# EasyEDA Pro project 小车.eprj

# Schematic Schematic1
Create Date: 2024-05-27; Page Name: P1; Project Name: 小车; Schematic Name: Schematic1; Update Date: 2024-06-05; Add into BOM: yes; Company: 嘉立创EDA; Convert to PCB: yes; Page Size: A4; Version: V1.0
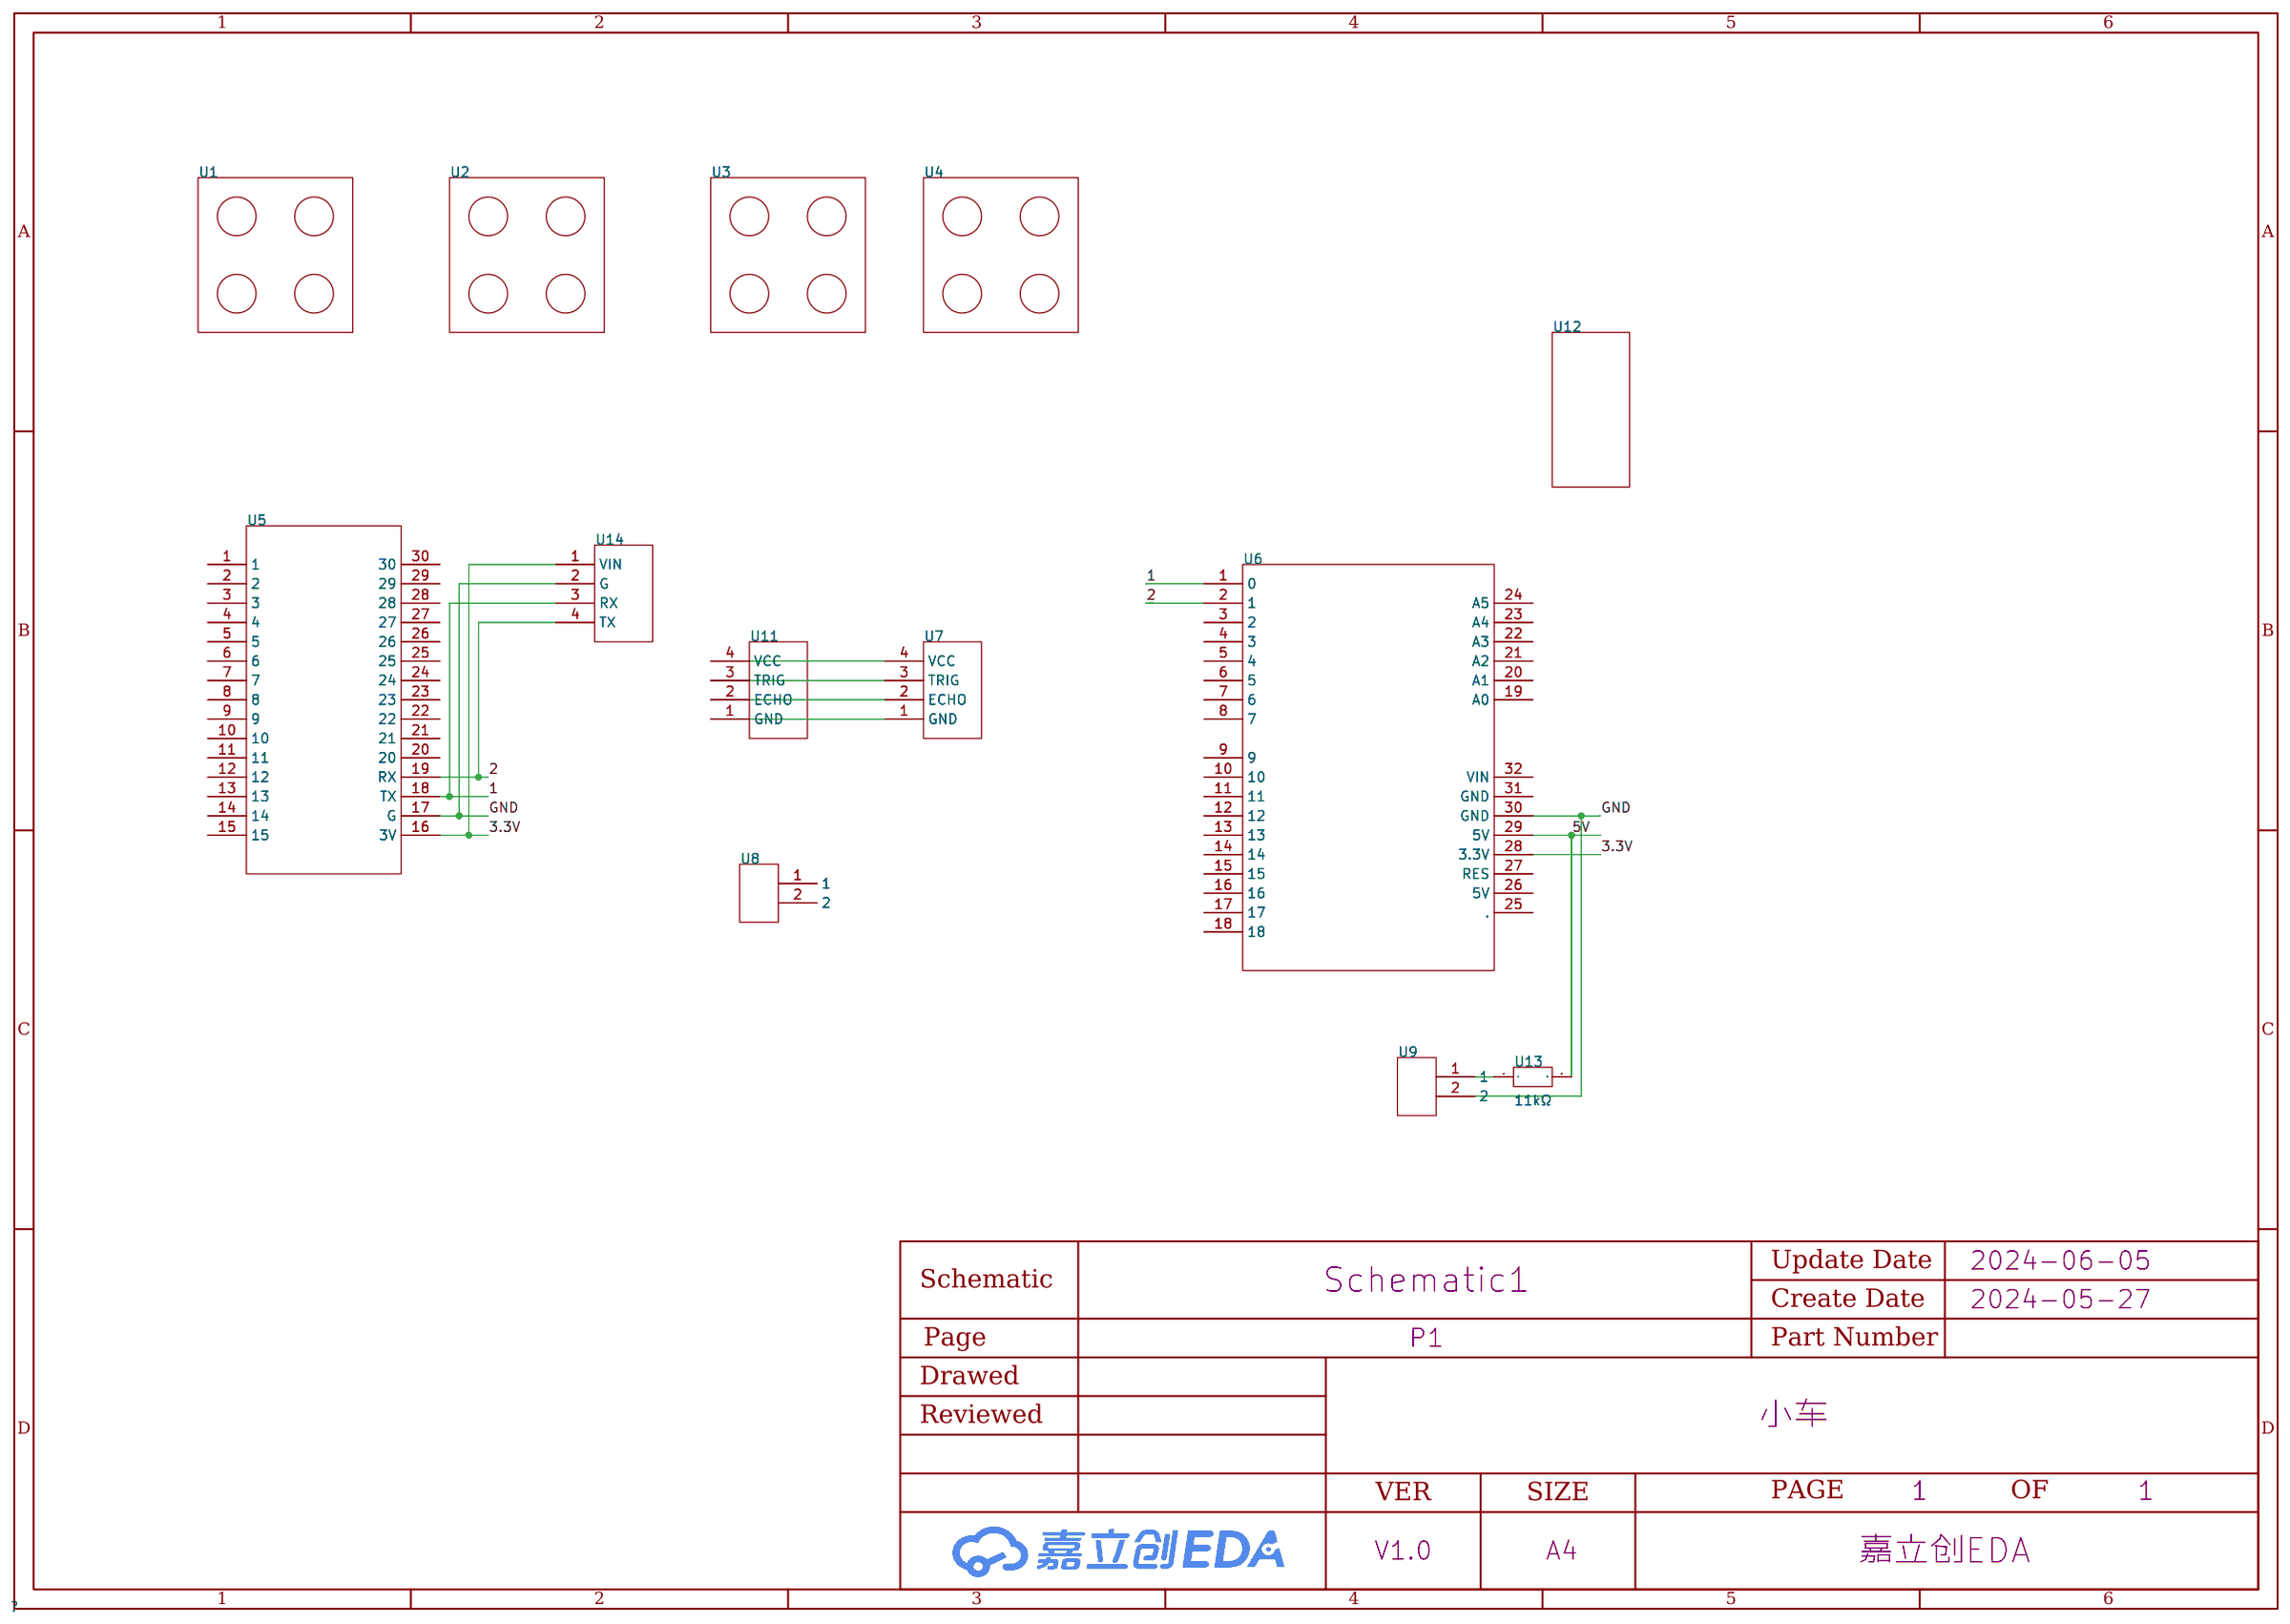
[diagram p0: schematic sheet]

## Parts
U1  -  [车轮]
U2  -  [车轮]
U3  -  [车轮]
U4  -  [车轮]
U5  -  [蓝牙]
U6  -  [开发板]
U7  -  [雷达]
U8  -  [开关]
U9  -  [开关]
U11  -  [雷达]
U12  -  [舵机]
U13  11kΩ  [RES-TH_BD2.3-L6.0-P10.00-D0.6]
U14  -  [OPENMV]

## Library data of the parts
U1-U4 = 车轮
U5 = 蓝牙
U6 = 开发板
U7 U11 = 雷达
U8 U9 = 开关
U12 = 舵机
U13 = RN55D1102FB14: 电阻类型:金属膜电阻;阻值:11kΩ;精度:±1%;功率:125mW;温度系数:±100ppm/℃;; LCSC Part Name: 金属膜电阻 11kΩ ±1% 125mW; Supplier Part: C1367638; Manufacturer: VISHAY(威世); Supplier Footprint: 插件,D2.3xL6.1mm; JLCPCB Part Class: 扩展库; Datasheet: https://atta.szlcsc.com/upload/public/pdf/source/20210608/50382EE0E4B78D1CB67FEFC4EAC5A602.pdf; Supplier: LCSC; Type: 金属膜电阻; Tolerance: ±1%; Power(Watts): 125mW; Temperature Coefficient: ±100ppm/℃; Operating Temperature Range: -65℃~+175℃
U14 = opnemv

## Nets
3.3V: U5.16(3V) U6.28(3.3V) U14.1(VIN)
5V: U6.29(5V) U13.2
GND: U5.17(G) U6.30(GND) U9.2 U14.2(G)
1: U5.18(TX) U6.1(0) U14.3(RX)
2: U5.19(RX) U6.2(1) U14.4(TX)
$1N1415: U9.1 U13.1
$1N1633: U7.4(VCC) U11.4(VCC)
$1N1636: U7.3(TRIG) U11.3(TRIG)
$1N1639: U7.2(ECHO) U11.2(ECHO)
$1N1642: U7.1(GND) U11.1(GND)

Not connected (* = marked no-connect by the designer): U5 1 2 3 4 5 6 7 8 9 10 11 12 13 14 15 20 21 22 23 24 25 26 27 28 29 30; U6 3(2) 4(3) 5(4) 6(5) 7(6) 8(7) 9 10 11 12 13 14 15 16 17 18 19(A0) 20(A1) 21(A2) 22(A3) 23(A4) 24(A5) 25(.) 26(5V) 27(RES) 31(GND) 32(VIN); U8 1 2

# Board PCB1
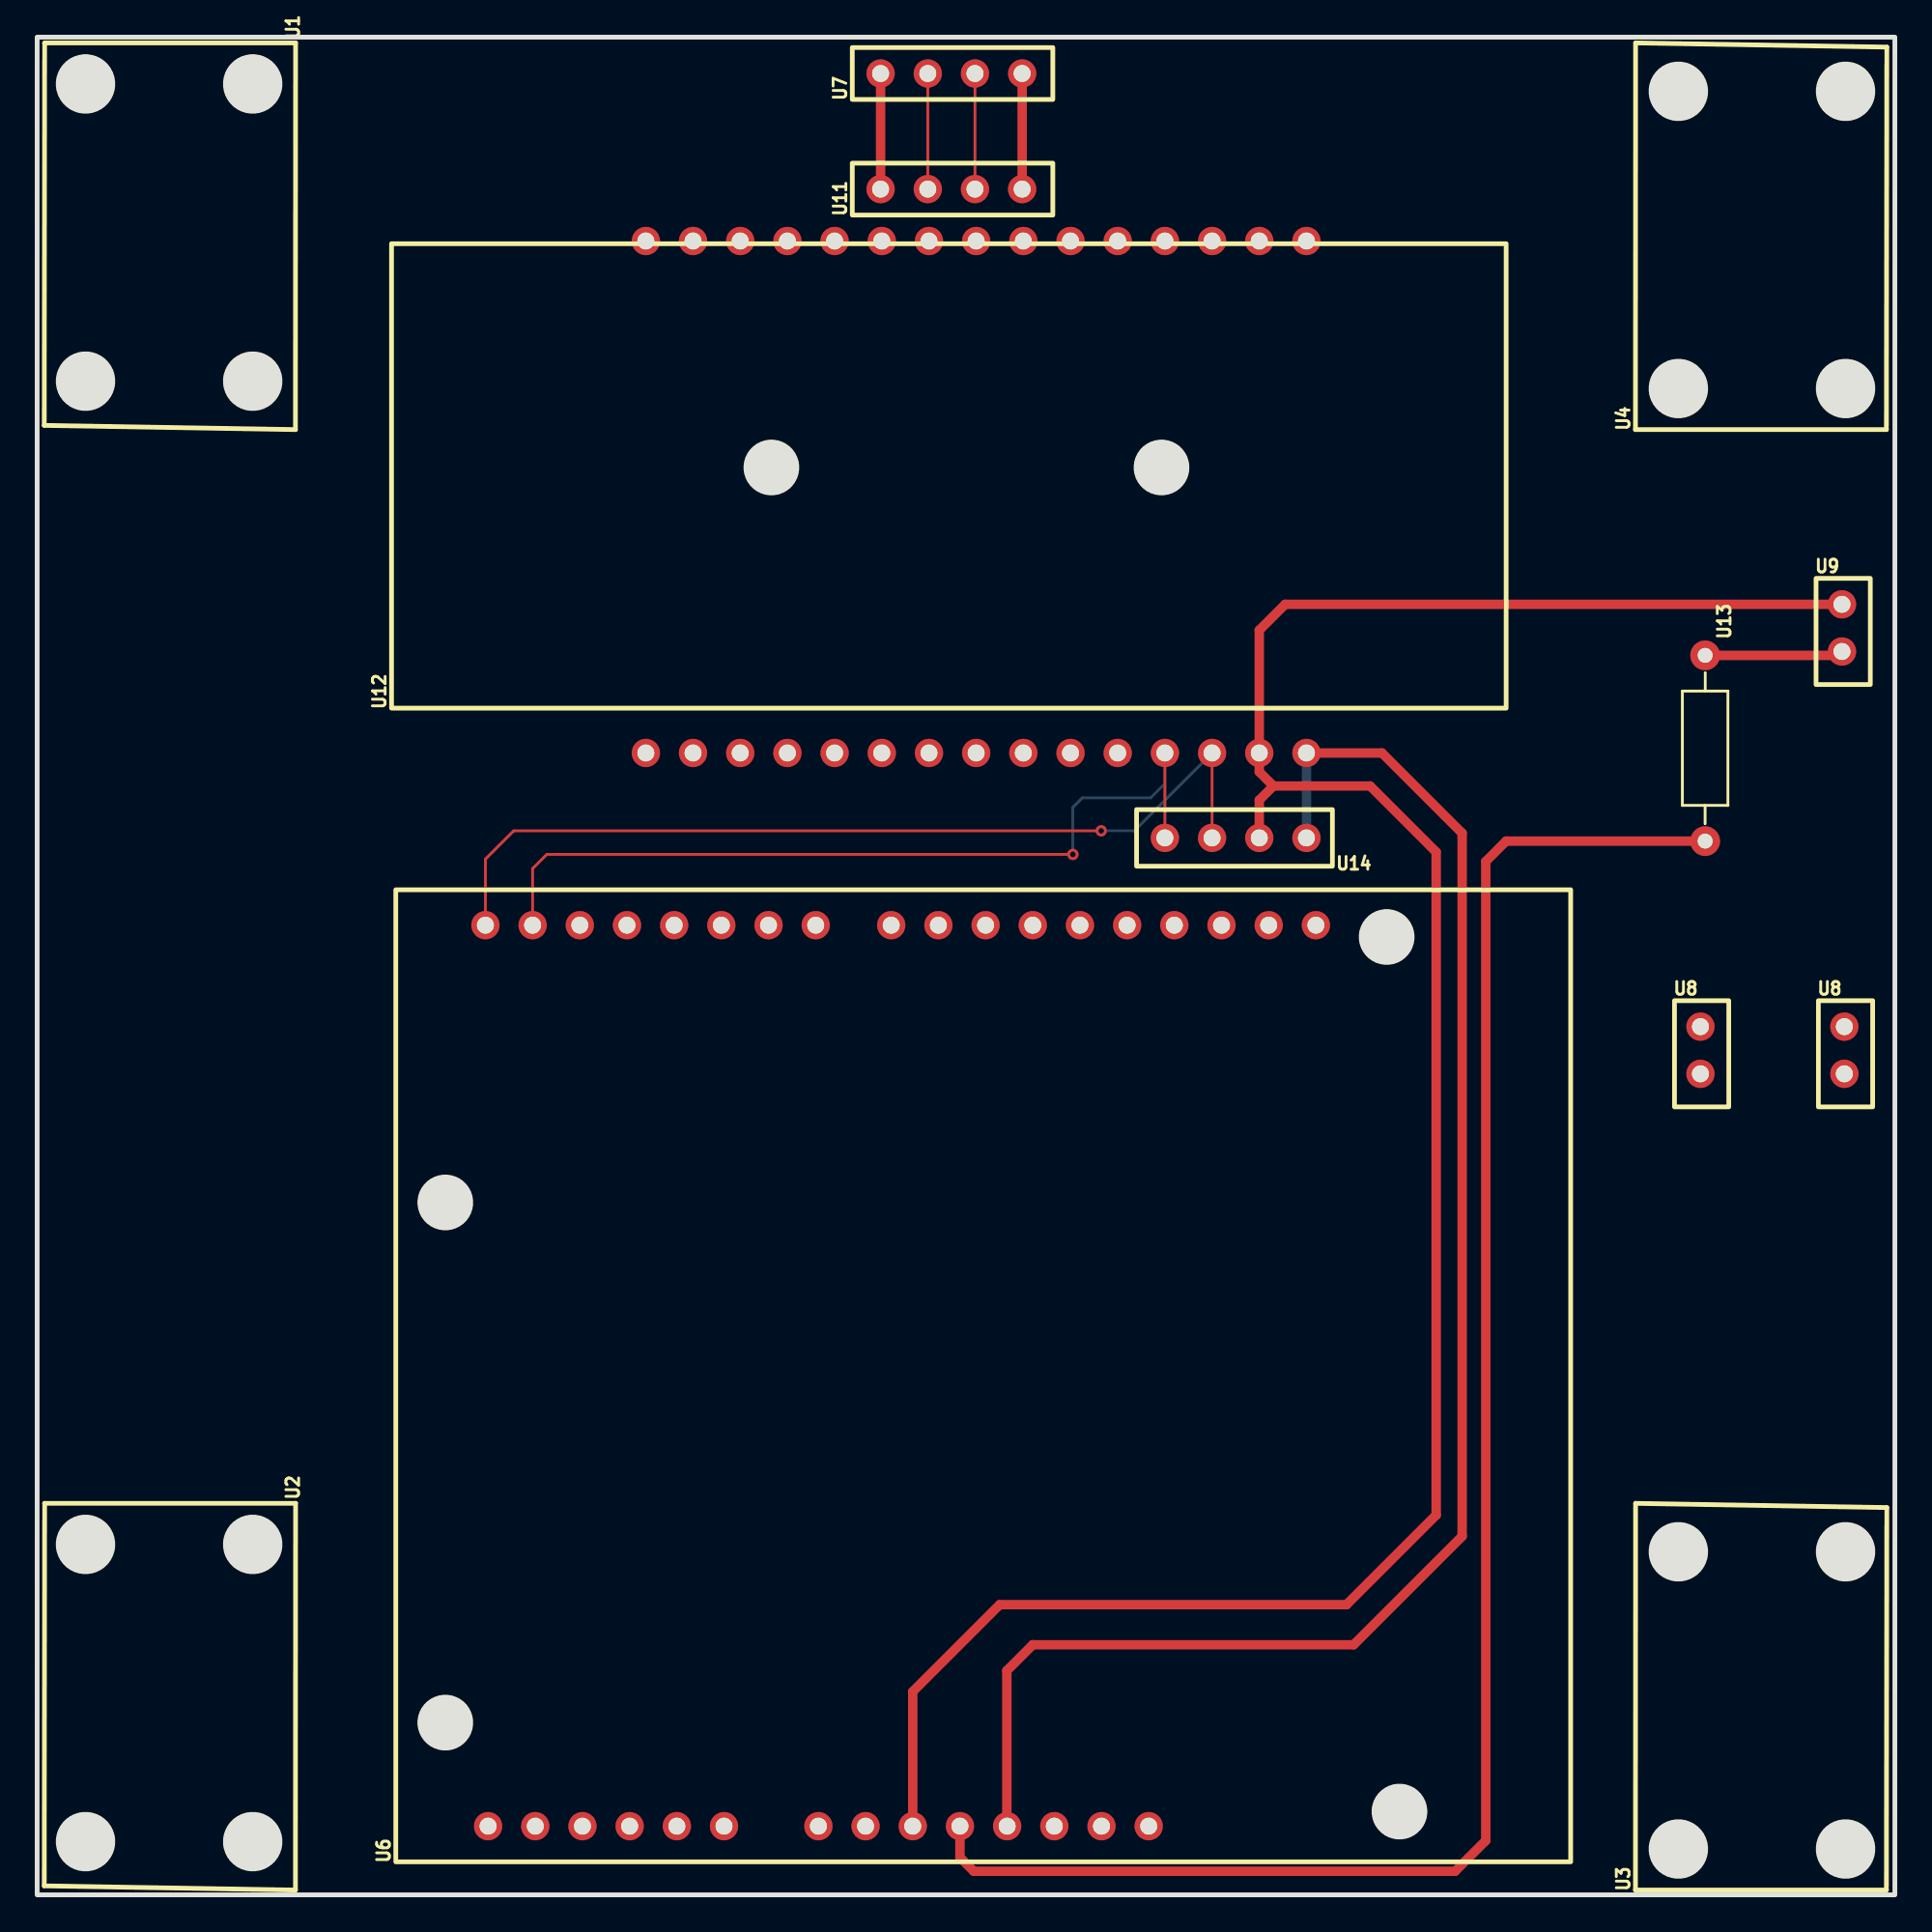
[diagram p1: board, top side]
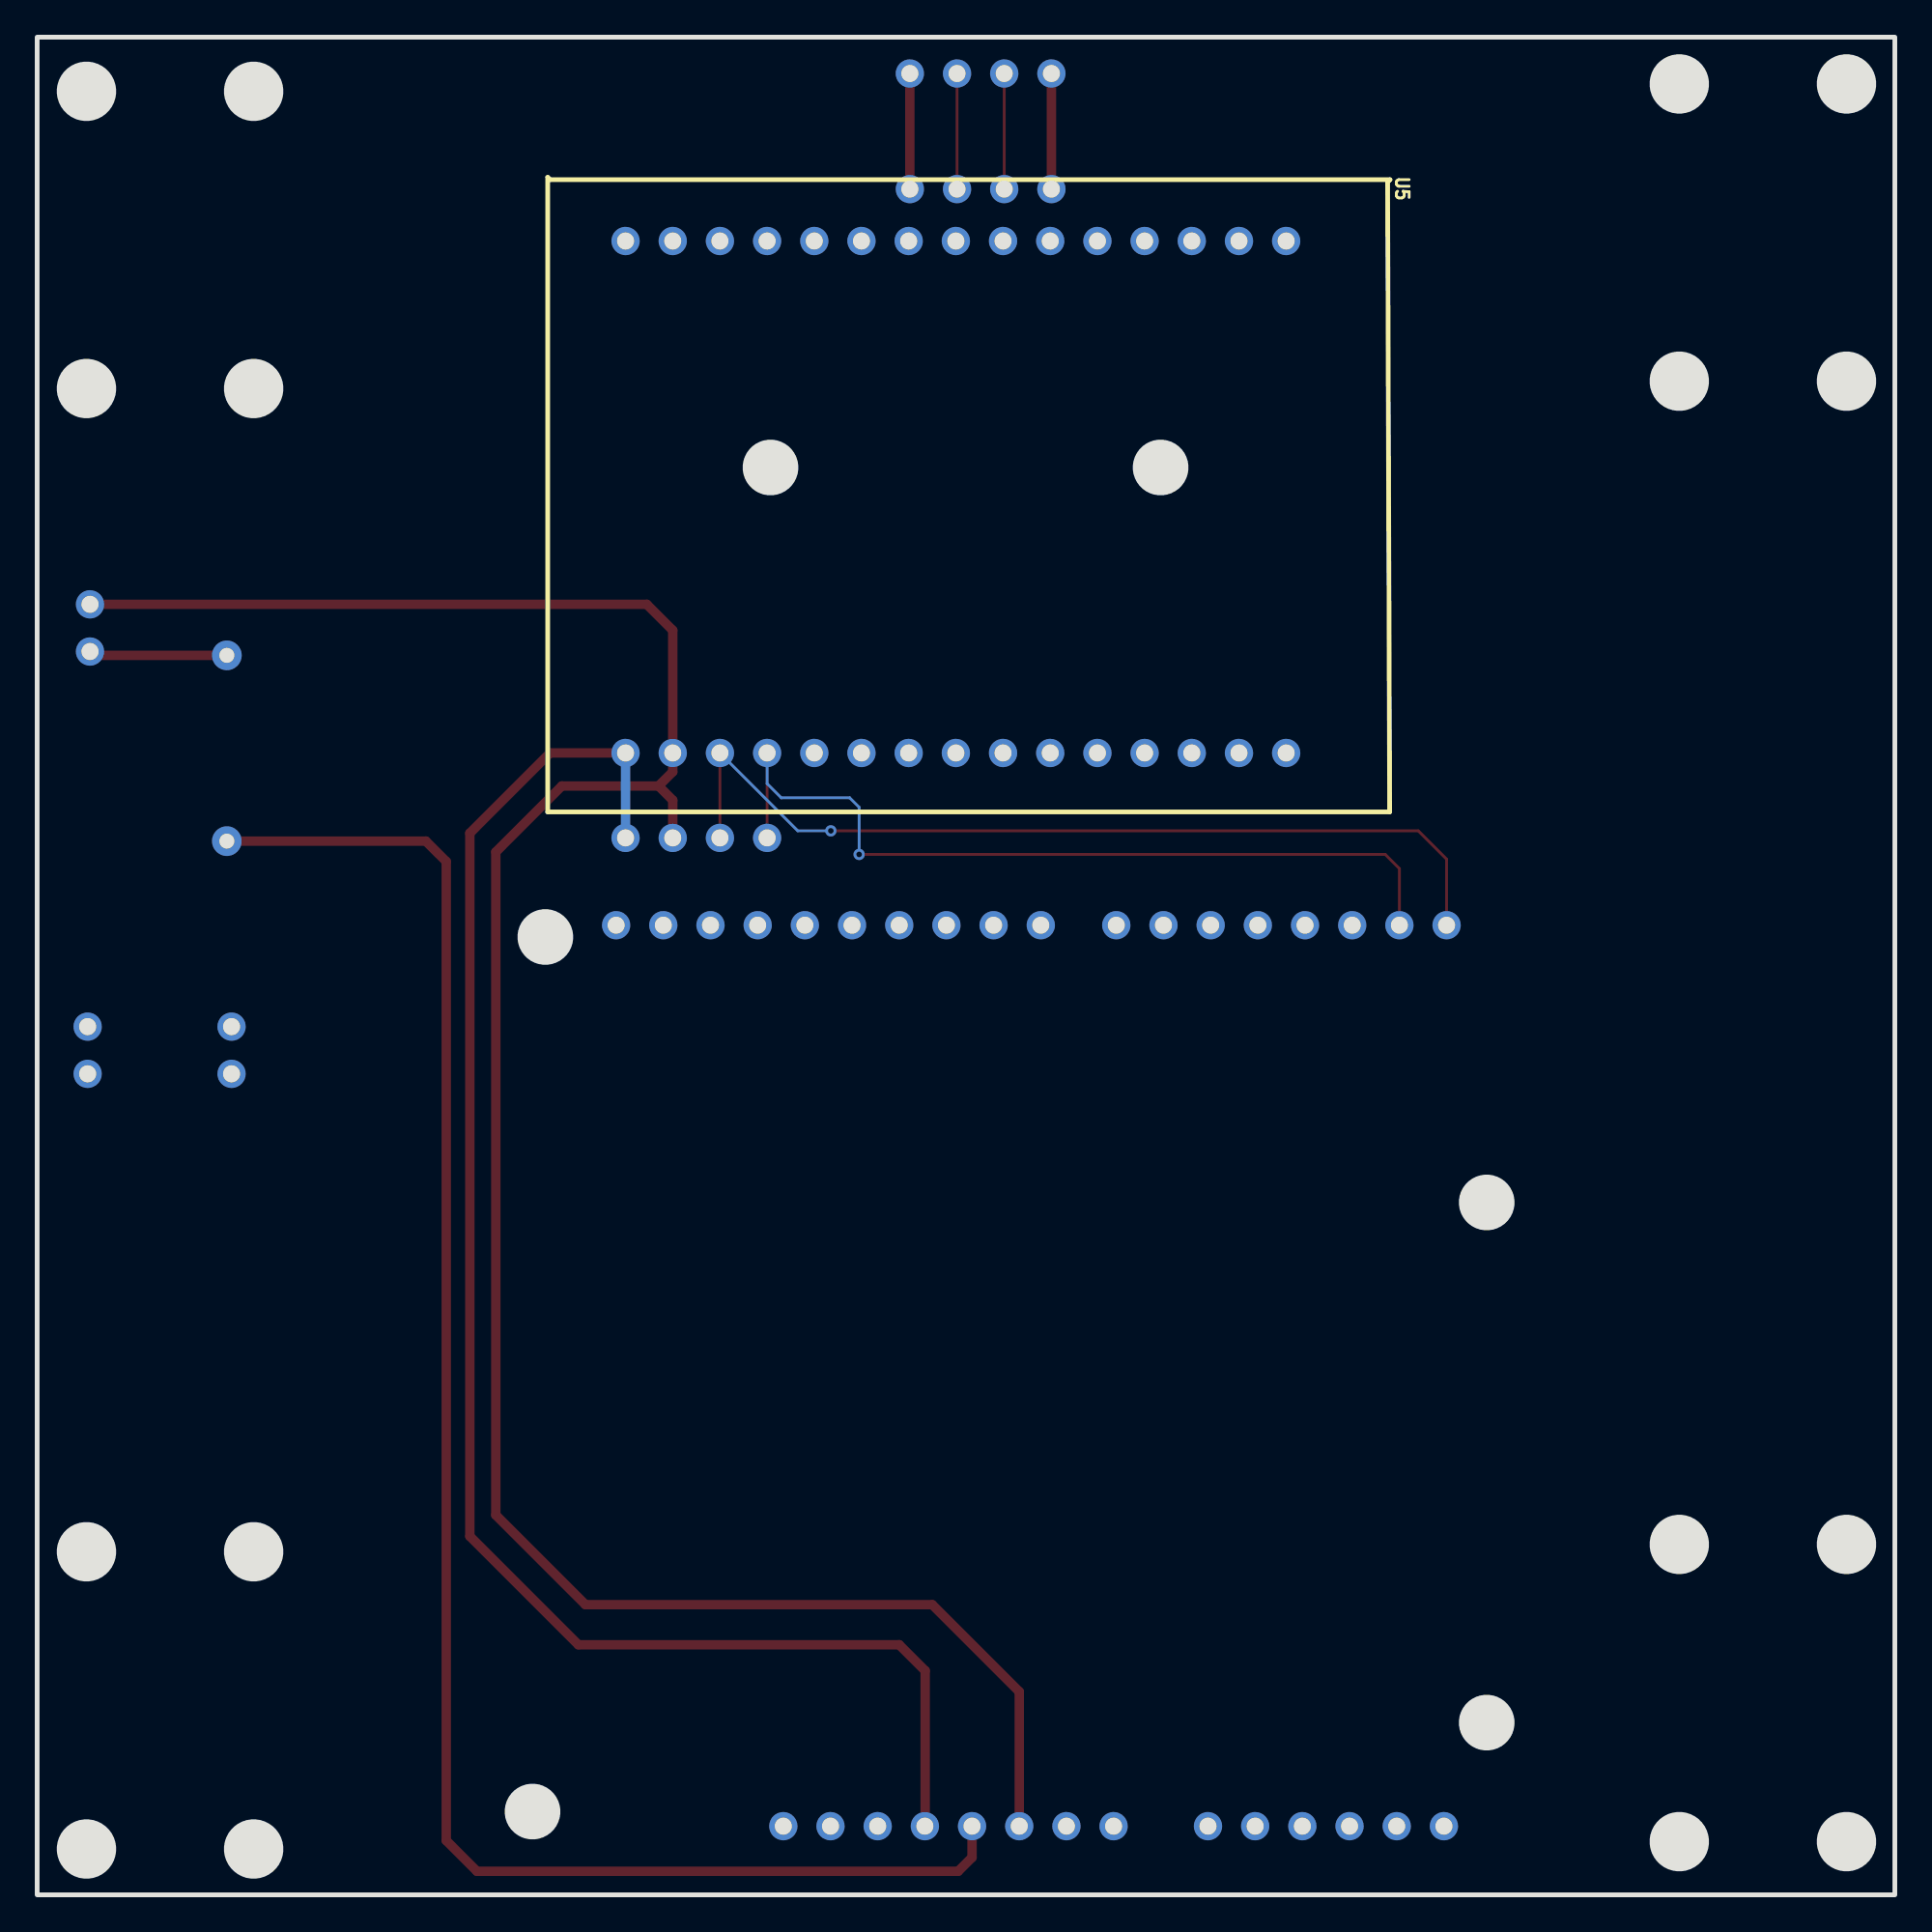
[diagram p2: board, bottom side, seen from below]

Outline 100 x 100 mm; copper layers: Top Layer, Bottom Layer. Coordinates in mm from the lower left corner of the outline.
Outline path: rectangle 0,100 100,0
Stack: Top Layer 0.035mm / Dielectric1 1.51mm FR4 er 4.5 / Bottom Layer 0.035mm

## Design rules (mm)
template: JLCPCB Capability(Two Layers Board)
spacing copperThickness1oz (default): track to track 0.102, other pairs 0.152 to 0.3
spacing copperThickness2oz: track to track 0.203, other pairs 0.152 to 0.3
track width copperThickness1oz (default): min 0.127, default 0.254, max 2.54
track width copperThickness2oz: min 0.203, default 0.254, max 2.54
differential pair differentialPair (default): width min 0.127, default 0.254, max 2.54; gap min 0.152, default 0.152
via viaSize (default): diameter min 0.5, default 0.61, max 10; hole min 0.3, default 0.305, max 6.3

## Placement (name value [footprint] x y rotation side)
U1  -  [车轮]  -1.4 101.98 270 top
U2  -  [车轮]  -1.4 23.36 270 top
U3  -  [车轮]  101.35 -2.03 90 top
U4  -  [车轮]  101.35 76.58 90 top
U5  -  [蓝牙]  68.33 89.03 270 bottom
U6  -  [开发板]  68.83 6.86 90 top
U7  -  [雷达]  53.02 98.04 90 top
U8  -  [开关]  97.28 44.2 0 top
U8#2  -  [开关]  89.53 44.2 0 top
U9  -  [开关]  97.16 66.93 0 top
U11  -  [雷达]  53.02 91.82 90 top
U12  -  [舵机]  39.75 76.83 90 top
U13  11kΩ  [RES-TH_BD2.3-L6.0-P10.00-D0.6]  89.79 61.72 270 top
U14  -  [OPENMV]  68.33 56.9 180 top

## Footprints (pads in the part's own frame, mm; a bottom-side part is the same pattern mirrored in y, then rotated)
OPENMV
  round 1.524 hole 0.914: 1(0,0) 2(2.54,0) 3(5.08,0) 4(7.62,0)
RES-TH_BD2.3-L6.0-P10.00-D0.6
  round 1.6 hole 0.8: 1(-5,0) 2(5,0)
开关
  round 1.524 hole 0.914: 1(0,0) 2(0,2.54)
开发板
  round 1.524 hole 0.914: 1(45.339,44.704) 2(45.339,42.164) 3(45.339,39.624) 4(45.339,37.084) 5(45.339,34.544) 6(45.339,32.004) 7(45.339,29.464) 8(45.339,26.924) 9(45.339,22.86) 10(45.339,20.32) 11(45.339,17.78) 12(45.339,15.24) 13(45.339,12.7) 14(45.339,10.16) 15(45.339,7.62) 16(45.339,5.08) 17(45.339,2.54) 18(45.339,0) 19(-3.161,44.56) 20(-3.161,42.02) 21(-3.161,39.48) 22(-3.161,36.94) 23(-3.161,34.4) 24(-3.161,31.86) 25(-3.161,26.779) 26(-3.161,24.24) 27(-3.161,21.7) 28(-3.161,19.16) 29(-3.161,16.62) 30(-3.161,14.08) 31(-3.161,11.54) 32(-3.161,9)
蓝牙
  round 1.524 hole 0.914: 1(0,35.56) 2(0,33.02) 3(0,30.48) 4(0,27.94) 5(0,25.4) 6(0,22.86) 7(0,20.32) 8(0,17.78) 9(0,15.24) 10(0,12.7) 11(0,10.16) 12(0,7.62) 13(0,5.08) 14(0,2.54) 15(0,0) 16(27.559,0) 17(27.559,2.54) 18(27.559,5.08) 19(27.559,7.62) 20(27.559,10.16) 21(27.559,12.7) 22(27.559,15.24) 23(27.559,17.78) 24(27.559,20.32) 25(27.559,22.86) 26(27.559,25.4) 27(27.559,27.94) 28(27.559,30.48) 29(27.559,33.02) 30(27.559,35.56)
雷达
  round 1.524 hole 0.914: 1(0,0) 2(0,2.54) 3(0,5.08) 4(0,7.62)

## Nets
3.3V: U5.16 U6.29 U14.1
5V: U6.28 U13.2
GND: U5.17 U6.27 U9.2 U14.2
1: U5.18 U6.1 U14.3
2: U5.19 U6.2 U14.4
$1N1415: U9.1 U13.1
$1N1633: U7.4 U11.4
$1N1636: U7.3 U11.3
$1N1639: U7.2 U11.2
$1N1642: U7.1 U11.1

Pads without a net: U5 1 2 3 4 5 6 7 8 9 10 11 12 13 14 15 20 21 22 23 24 25 26 27 28 29 30; U6 3 4 5 6 7 8 9 10 11 12 13 14 15 16 17 18 19 20 21 22 23 24 25 26 30 31 32; U8 1 2; U8#2 1 2

## Via types
v1: diameter 0.61, hole 0.305, Top Layer to Bottom Layer, 2 vias

## Routing (per net, layer and track width the routed paths; a pad name or vN(x,y) marks a point on that pad's centre or on a via; arc(x,y) is an arc through that point)
3.3V: length 88.9
  Top Layer w0.508: U5.16 72.39,61.47 76.71,57.15 76.71,19.3 70.87,13.46 53.59,13.46 52.2,12.06 52.2,3.71 U6.29 52.21,3.32 52.2,3.3
  Bottom Layer w0.508: U14.1 U5.16
5V: length 95.9
  Top Layer w0.508: U6.28 49.67,2.01 50.42,1.27 76.33,1.27 77.98,2.92 77.98,55.63 79.07,56.72 U13.2
GND: length 129
  Top Layer w0.508: U6.27 47.13,10.94 51.82,15.62 70.49,15.62 75.31,20.45 75.31,56.13 71.75,59.69 66.55,59.69 ; U14.2 65.79,58.93 66.55,59.69 ; 66.55,59.69 65.79,60.45 U5.17 65.79,68.07 67.18,69.47 97.16,69.47
1: length 49.6
  Top Layer w0.152: U5.18 U14.3 ; v1(57.28,57.28) 25.65,57.28 24.13,55.75 U6.1
  Bottom Layer w0.152: v1(57.28,57.28) 59.06,57.28 U5.18
2: length 46.7
  Top Layer w0.152: U6.2 26.67,55.25 27.43,56.01 v1(55.75,56.01) ; U5.19 U14.4
  Bottom Layer w0.152: v1(55.75,56.01) 55.75,58.55 56.26,59.06 59.94,59.06 60.71,59.82 U5.19
$1N1415: length 7.5
  Top Layer w0.508: U13.1 96.95,66.72 U9.1
$1N1633: length 6.2
  Top Layer w0.508: U7.4 U11.4
$1N1636: length 6.2
  Top Layer w0.152: U7.3 U11.3
$1N1639: length 6.2
  Top Layer w0.152: U7.2 U11.2
$1N1642: length 6.2
  Top Layer w0.508: U7.1 U11.1
